# EAGLE schematic schematic_esp32_I2S_lcd_16x2_OR_lcd_20x4 (EAGLE 9.6.2)
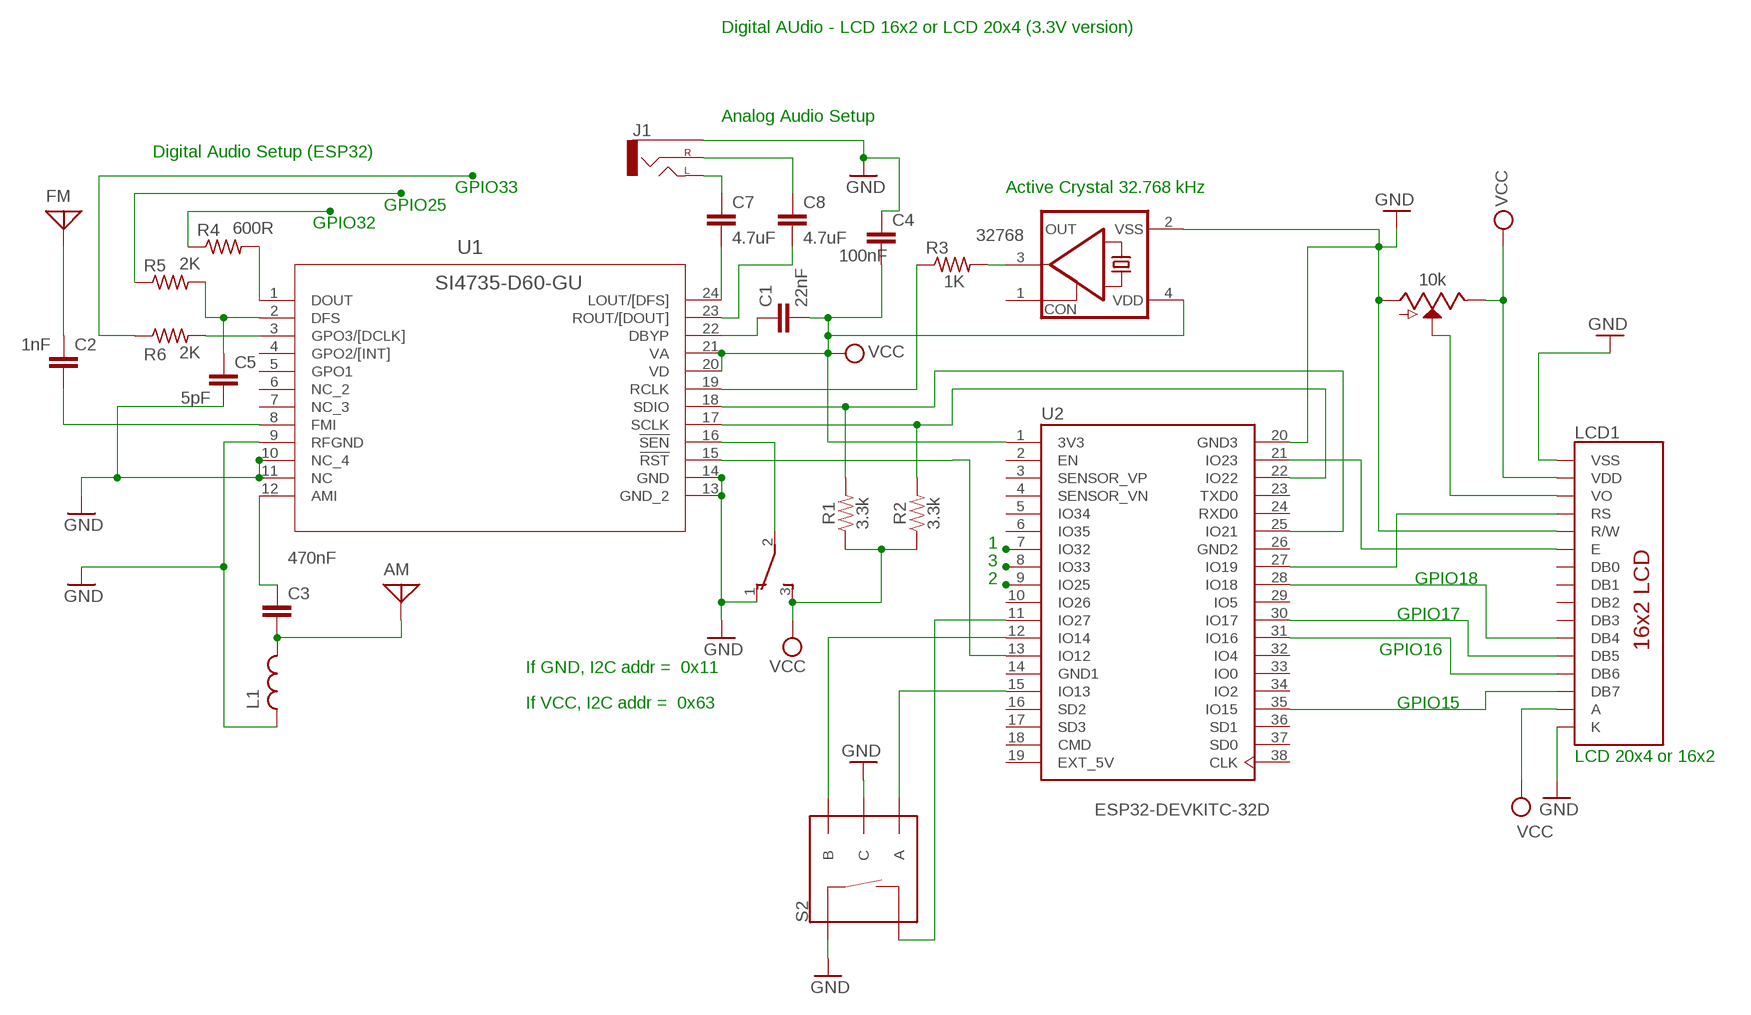
[diagram p0: schematic, sheet 1]

## Parts
AM  ANTENNA  [PAD-01]
C1  22nF  22NF/22,000PF-0603-50V-10%  [0603]
C2  1nF  CXXC10B6  [XC10B6]
C3  470nF  CXXC10B6  [XC10B6]
C4  100nF  CXXC10B6  [XC10B6]
C5  5pF  CXXC10B6  [XC10B6]
C7  4.7uF  4.7UF-1206-16V-(+80/-20%)  [1206]
C8  4.7uF  4.7UF-1206-16V-(+80/-20%)  [1206]
FM  ANTENNA  [PAD-01]
J1  AUDIO_JACK_2.5MMSPECIAL_POGO_PINS  [STEREOJACK2.5MM_SPECIAL_POGOPINS]
L1  L  (no package)
LCD1  LCD-16X28X2  [LCD-8X2]
OS1  OSC-OE-CFPS-9  [5.2X3.4-4-PAD]
R1  3.3k  3.3KOHM-0603-1/10W-1%  [0603]
R2  3.3k  3.3KOHM-0603-1/10W-1%  [0603]
R3  1K  R-US_0204/2V  [0204V]
R4  600R  R-US_0204/2V  [0204V]
R5  2K  R-US_0204/2V  [0204V]
R6  2K  R-US_0204/2V  [0204V]
S1  TL36WO  [TL3XWO]
S2  ENCODER-SWITCH  [ROTARY_ENC_PLAIN]
U1  SI4735-D60-GU  [SSOP24_SIL]
U2  ESP32-DEVKITC-32D  [MODULE_ESP32-DEVKITC-32D]
VR1  10k  POTENTIOMETER-PTH-9MM-1/20W-20%  [POT-PTH-ALPS]

## Nets
GND: C4.1 C5.2 J1.RING1(SLEEVE) L1.1 LCD1.1(VSS) LCD1.5(R/W) LCD1.16(K) OS1.2(VSS) S1.1(O) S2.C S2.SW+ U1.9(RFGND) U1.10(NC_4) U1.11(NC) U1.13(GND_2) U1.14(GND) U2.20(GND3) VR1.P$3(A)
N$1: C2.1 FM.1
N$2: S1.2(P) U1.16(!SEN)
N$3: OS1.3(OUT) R3.2
N$4: C1.1 U1.22(DBYP)
N$5: R3.1 U1.19(RCLK)
N$6: C7.2 U1.24(LOUT/[DFS])
N$7: C8.2 U1.23(ROUT/[DOUT])
N$8: C7.1 J1.SHIELD(LEFT)
N$9: C8.1 J1.TIP(RIGHT)
N$10: AM.1 C3.2 L1.2
N$11: R4.2 U1.1(DOUT)
N$12: C3.1 U1.12(AMI)
N$13: C2.2 U1.8(FMI)
N$14: S2.B U2.12(IO14)
N$15: R1.2 U1.18(SDIO) U2.25(IO21)
N$16: S2.A U2.15(IO13)
N$17: U1.15(!RST) U2.13(IO12)
N$18: S2.SW- U2.11(IO27)
N$19: LCD1.6(E) U2.21(IO23)
N$20: LCD1.4(RS) U2.27(IO19)
N$21: LCD1.3(VO) VR1.P$2(S)
N$22: LCD1.11(DB4) U2.28(IO18)
N$23: LCD1.12(DB5) U2.30(IO17)
N$24: LCD1.13(DB6) U2.31(IO16)
N$25: LCD1.14(DB7) U2.35(IO15)
N$26: C5.1 R5.2 U1.2(DFS)
N$27: R6.2 U1.3(GPO3/[DCLK])
N$28: R6.1
N$29: R4.1
N$30: R5.1
N$31: U2.7(IO32)
N$32: U2.8(IO33)
N$33: U2.9(IO25)
SDA: R2.2 U1.17(SCLK) U2.22(IO22)
VCC: C1.2 C4.2 LCD1.2(VDD) LCD1.15(A) OS1.4(VDD) R1.1 R2.1 S1.3(S) U1.20(VD) U1.21(VA) U2.1(3V3) VR1.P$1(E)
Unconnected: LCD1.7(DB0) LCD1.8(DB1) LCD1.9(DB2) LCD1.10(DB3) OS1.1(CON) U1.4(GPO2/[INT]) U1.5(GPO1) U1.6(NC_2) U1.7(NC_3) U2.2(EN) U2.3(SENSOR_VP) U2.4(SENSOR_VN) U2.5(IO34) U2.6(IO35) U2.10(IO26) U2.16(SD2) U2.17(SD3) U2.18(CMD) U2.23(TXD0) U2.24(RXD0) U2.29(IO5) U2.32(IO4) U2.33(IO0) U2.34(IO2) U2.36(SD1) U2.37(SD0) U2.38(CLK)

## Notes on the sheet
- Digital AUdio - LCD 16x2 or LCD 20x4 (3.3V version)
- Analog Audio Setup
- Digital Audio Setup (ESP32)
- GPIO33 | Active Crystal 32.768 kHz
- GPIO25
- GPIO32
- 1
- 3
- 2 | GPIO18
- GPIO17
- GPIO16
- If GND, I2C addr =  0x11
- If VCC, I2C addr =  0x63 | GPIO15
- LCD 20x4 or 16x2

## Power pins joined to a net without a drawn wire
EXT_5V: U2.19(EXT_5V)
GND1: U2.14(GND1)
GND2: U2.26(GND2)

## Library data of the parts
AM FM = discrete:ANTENNA: Antenna
C1 = SparkFun-Capacitors:22NF/22,000PF: 0.022uF/22nF/22,000pF ceramic capacitors A capacitor is a passive two-terminal electrical component used to store electrical energy temporarily in an electric field.; PROD_ID: CAP-07885
C2-C5 = rcl:CX: X CAPACITOR for power line; SPICEPREFIX: C
C7 C8 = SparkFun-Capacitors:4.7UF: 4.7µF ceramic capacitors A capacitor is a passive two-terminal electrical component used to store electrical energy temporarily in an electric field.; PROD_ID: CAP-10300
J1 = SparkFun-Connectors:AUDIO_JACK_2.5MM: Audio Jack 2.5mm variants of PTH and SMT audio jacks. SparkFun Products: SparkFun PicoBoard <https://www.sparkfun.com/products/11888>- 2.5mm SMD
L1 = ngspice-simulation:L: INDUCTOR
LCD1 = SparkFun-Displays:LCD-16X2: Standard text-only 16x2 parallel input LCD Basic 16 character by 2 line display. Typically utilizes the extremely common HD44780 parallel interface chipset SparkFun Products: Basic 16x2 Green <https://www.sparkfun.com/products/255> Basic 8x2 Green <https://www.sparkfun.com/products/11122>; SF_ID: LCD-11122
OS1 = IQD-Frequency-Products:OSC-OE: OSCILLATOR WITH OE; FREQ: 32768
R1 R2 = SparkFun-Resistors:3.3KOHM: 3.3kΩ resistor A resistor is a passive two-terminal electrical component that implements electrical resistance as a circuit element. Resistors act to reduce current flow, and, at the same time, act to lower voltage levels within circuits. - Wikipedia; PROD_ID: RES-07851
R3-R6 = rcl:R-US_: RESISTOR, American symbol; SPICEPREFIX: R
S1 = switch:TL36WO: TINY SWITCH ON - ON Source: http://www2.produktinfo.conrad.com/datenblaetter/700000-724999/705152-da-01-de-Subminiaturschalter_TL_36WO.pdf
S2 = SparkFun-Switches:ENCODER-SWITCH: Rotary Encoder w/ Select Switch Encoders rotate similarly to potentiometers, but they’re different from potentiometers in that an encoder has full rotation without limits. They output gray code so that you can tell how much and in which direction the encoder has been turned. This encoder includes a push-down select switch built into the shaft. SparkFun Products Rotary Encoder <https://www.sparkfun.com/products/9117> (COM-09117); SF_SKU: COM-09117
U1 = si4735:SI4735-D60-GU; BUILT_BY: EMA_Cory; COPYRIGHT: Copyright (C) 2018 Accelerated Designs. All rights reserved; DATASHEET: https://www.silabs.com/documents/public/data-sheets/Si4730-31-34-35-D60.pdf; MANUFACTURER_PART_NUMBER: SI4735-D60-GU; SOURCELIBRARY: Silicon_Labs_2020-04-23; VENDOR: Silicon Labs
U2 = ESP32-DEVKITC-32D:ESP32-DEVKITC-32D: Eval Board For Esp-Wroom-32 Check prices <https://pricing.snapeda.com/parts/ESP32-DEVKITC-32D/Espressif%20Systems/view-part?ref=eda>; AVAILABILITY: Warning; DESCRIPTION: WiFi Development Tools (802.11) ESP32 General Development Kit, ESP32-WROOM-32D on the board; MF: Espressif Systems; MP: ESP32-DEVKITC-32D; PACKAGE: None; PRICE: None; PURCHASE-URL: https://pricing.snapeda.com/search/part/ESP32-DEVKITC-32D/?ref=eda
VR1 = SparkFun-Resistors:POTENTIOMETER: Potentiometer (Pot) Three-terminal potentiometers, with an adjustable wiper and two adjustable resistors. A pot can be used to create a configurable voltage divider, or as a variable resistor. Variants ALPS_POT and ALPS_POT_KIT - PTH, breadboard compatible, 9mm square pots Rotary Potentiometer - Linear (10k ohm) <https://www.sparkfun.com/products/9288> (COM-09288) The KIT variant exposes copper on only one side of the PTH pad, so the part can only be assembled on one side of the PCB. Useful for beginner soldering kits.; PROD_ID: RES-09177; SF_SKU: COM-09288